# EAGLE design MSGP_rev2 (EAGLE 7.2.0)
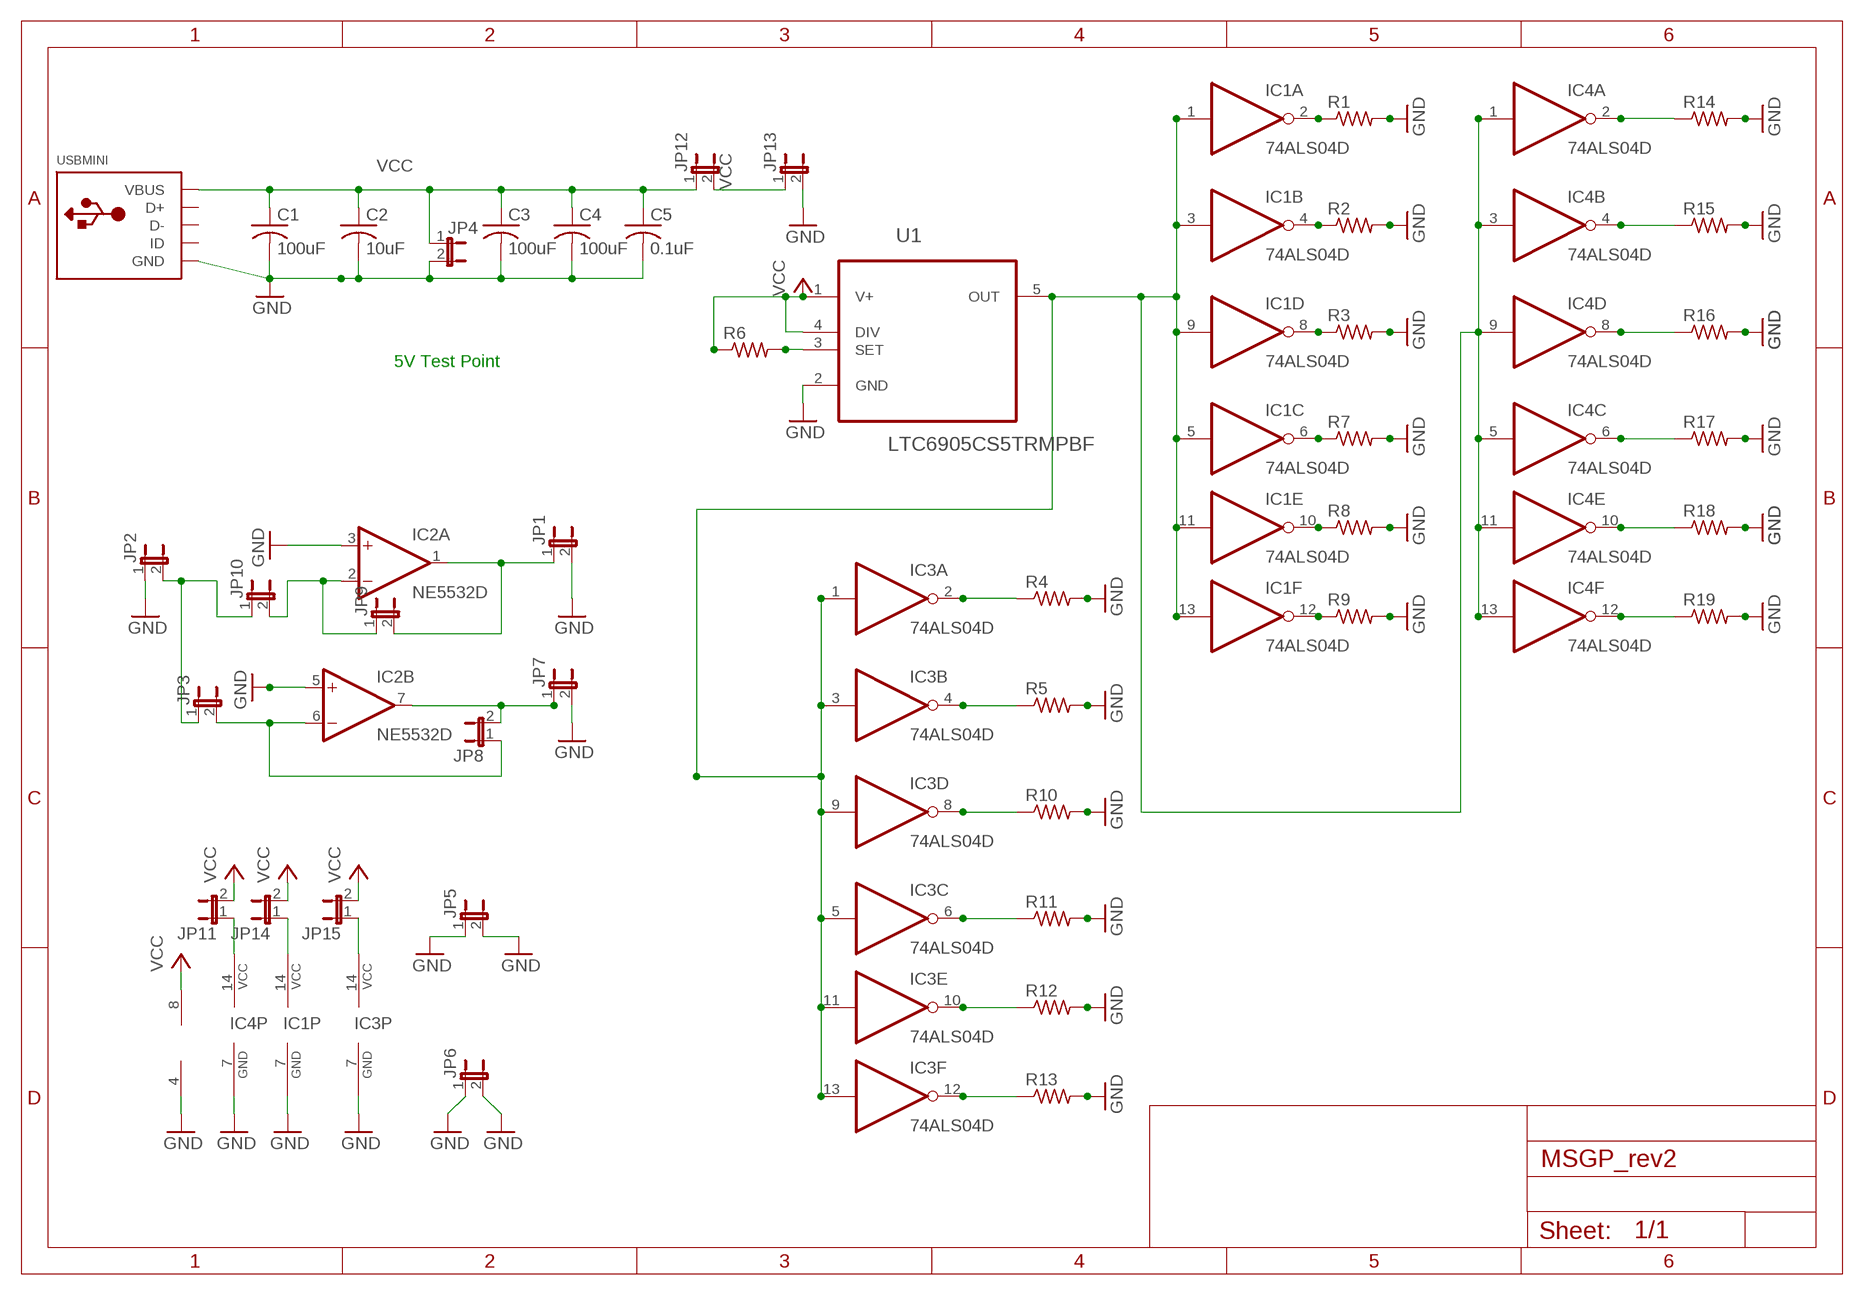
[diagram p0: schematic, sheet 1]

## Parts
C1  100uF  C-USC1206K  [C1206K]
C2  10uF  C-USC1206K  [C1206K]
C3  100uF  C-USC1206K  [C1206K]
C4  100uF  C-USC1206K  [C1206K]
C5  0.1uF  C-USC1206K  [C1206K]
IC1  74ALS04D  [SO14]
IC2  NE5532D  [SO08]
IC3  74ALS04D  [SO14]
IC4  74ALS04D  [SO14]
JP1  JP1E  [JP1]
JP2  JP1E  [JP1]
JP3  JP1E  [JP1]
JP4  JP1E  [JP1]
JP5  JP1E  [JP1]
JP6  JP1E  [JP1]
JP7  JP1E  [JP1]
JP8  JP1E  [JP1]
JP9  JP1E  [JP1]
JP10  JP1E  [JP1]
JP11  JP1E  [JP1]
JP12  JP1E  [JP1]
JP13  JP1E  [JP1]
JP14  JP1E  [JP1]
JP15  JP1E  [JP1]
R1  R-US_0204/2V  [0204V]
R2  R-US_0204/2V  [0204V]
R3  R-US_0204/2V  [0204V]
R4  R-US_0204/2V  [0204V]
R5  R-US_0204/2V  [0204V]
R6  R-US_0204/2V  [0204V]
R7  R-US_0204/2V  [0204V]
R8  R-US_0204/2V  [0204V]
R9  R-US_0204/2V  [0204V]
R10  R-US_0204/2V  [0204V]
R11  R-US_0204/2V  [0204V]
R12  R-US_0204/2V  [0204V]
R13  R-US_0204/2V  [0204V]
R14  R-US_0204/2V  [0204V]
R15  R-US_0204/2V  [0204V]
R16  R-US_0204/2V  [0204V]
R17  R-US_0204/2V  [0204V]
R18  R-US_0204/2V  [0204V]
R19  R-US_0204/2V  [0204V]
U1  LTC6905CS5TRMPBF  [SOT95P280X100-5N]
USBMINI  USBMINIB  [USB-MINIB]

## Nets
GND_D: IC1.7(P:GND) IC3.7(P:GND) IC4.7(P:GND) JP5.1 JP6.1 R1.2 R2.2 R3.2 R4.2 R5.2 R7.2 R8.2 R9.2 R10.2 R11.2 R12.2 R13.2 R14.2 R15.2 R16.2 R17.2 R18.2 R19.2 U1.2(GND) ; supply symbol labelled GND
GNDA: C1.2 C2.2 C3.2 C4.2 C5.2 IC2.3(A:+IN) IC2.4(P:V-) IC2.5(B:+IN) JP1.2 JP2.1 JP4.2 JP5.2 JP6.2 JP7.2 JP13.2 USBMINI.GND ; supply symbol labelled GND
N$1: IC1.1(A:I) IC1.3(B:I) IC1.5(C:I) IC1.9(D:I) IC1.11(E:I) IC1.13(F:I) IC3.1(A:I) IC3.3(B:I) IC3.5(C:I) IC3.9(D:I) IC3.11(E:I) IC3.13(F:I) IC4.1(A:I) IC4.3(B:I) IC4.5(C:I) IC4.9(D:I) IC4.11(E:I) IC4.13(F:I) U1.5(OUT)
N$2: IC2.6(B:-IN) JP3.2 JP8.1
N$3: IC2.1(A:OUT) JP1.1 JP9.2
N$4: IC1.10(E:O) R8.1
N$5: IC2.2(A:-IN) JP9.1 JP10.2
N$6: R6.2 U1.3(SET)
N$7: IC1.2(A:O) R1.1
N$8: IC1.4(B:O) R2.1
N$9: IC1.8(D:O) R3.1
N$10: IC1.6(C:O) R7.1
N$11: IC1.12(F:O) R9.1
N$12: IC2.7(B:OUT) JP7.1 JP8.2
N$14: IC3.10(E:O) R12.1
N$15: IC4.14(P:VCC) JP11.1
N$16: IC3.2(A:O) R4.1
N$17: IC3.4(B:O) R5.1
N$18: IC3.8(D:O) R10.1
N$19: IC3.6(C:O) R11.1
N$20: IC3.12(F:O) R13.1
N$21: IC4.10(E:O) R18.1
N$22: IC1.14(P:VCC) JP14.1
N$23: IC4.2(A:O) R14.1
N$24: IC4.4(B:O) R15.1
N$25: IC4.8(D:O) R16.1
N$26: IC4.6(C:O) R17.1
N$27: IC4.12(F:O) R19.1
N$28: IC3.14(P:VCC) JP15.1
N$30: JP2.2 JP3.1 JP10.1
VCC: C1.1 C2.1 C3.1 C4.1 C5.1 IC2.8(P:V+) JP4.1 JP11.2 JP12.1 JP12.2 JP13.1 JP14.2 JP15.2 R6.1 U1.1(V+) U1.4(DIV) USBMINI.VBUS
Unconnected: USBMINI.D+ USBMINI.D- USBMINI.ID

## Notes on the sheet
- 5V Test Point

## Library data of the parts
C1-C5 = adafruit:C-US: CAPACITOR, American symbol
IC1 IC3 IC4 = 74xx-us:74*04: Hex INVERTER
IC2 = linear:NE5532: AUDIO AMPLIFIER
JP1-JP15 = jumper:JP1E: JUMPER
R1-R19 = resistor:R-US_: RESISTOR, American symbol
U1 = LTC_By_element14_Batch_1:LTC6905CS5TRMPBF: 17MHz to 170MHz Resistor Oscillator; MPN: LTC6905CS5#TRMPBF; OC_FARNELL: 1663923; OC_NEWARK: 19P0750; PACKAGE: SOT-23-5; SUPPLIER: Linear Technology
USBMINI = adafruit:USB: USB Connectors USBMINIB - Surface Mount Female Mini-B USB Connector 4UConnector: 06564 By microbuilder.eu Thru-hole RA Female Mini-B USB Connector 4UConnector: 18732 By ladyada.net

## Board
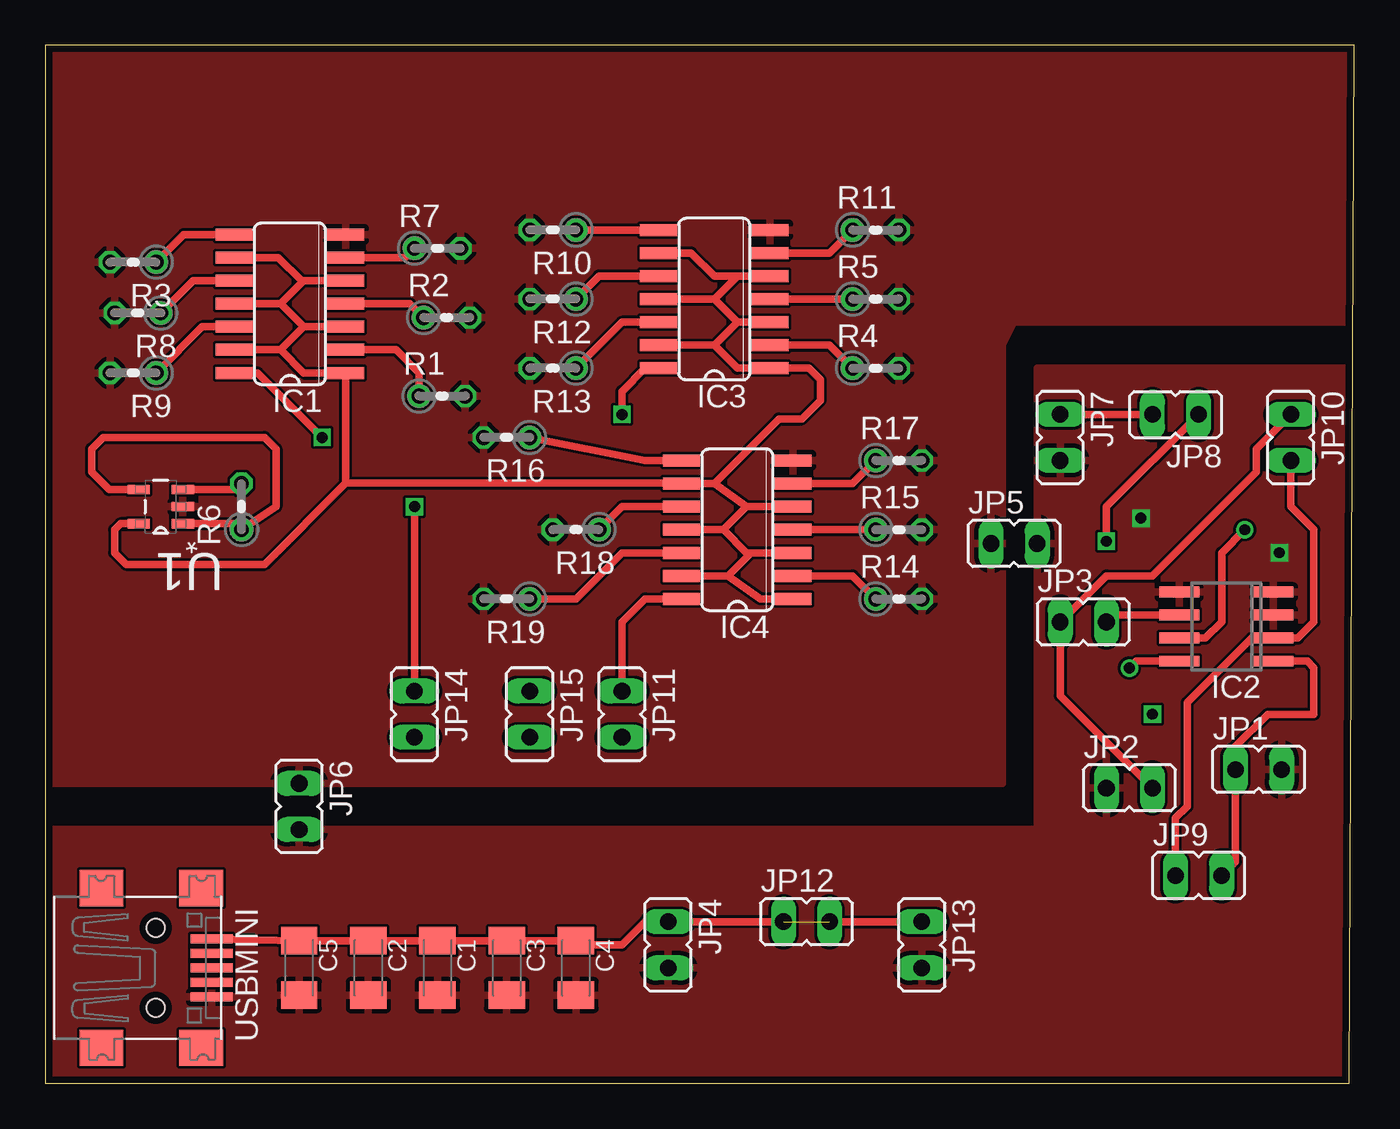
[diagram p1: board, top side]
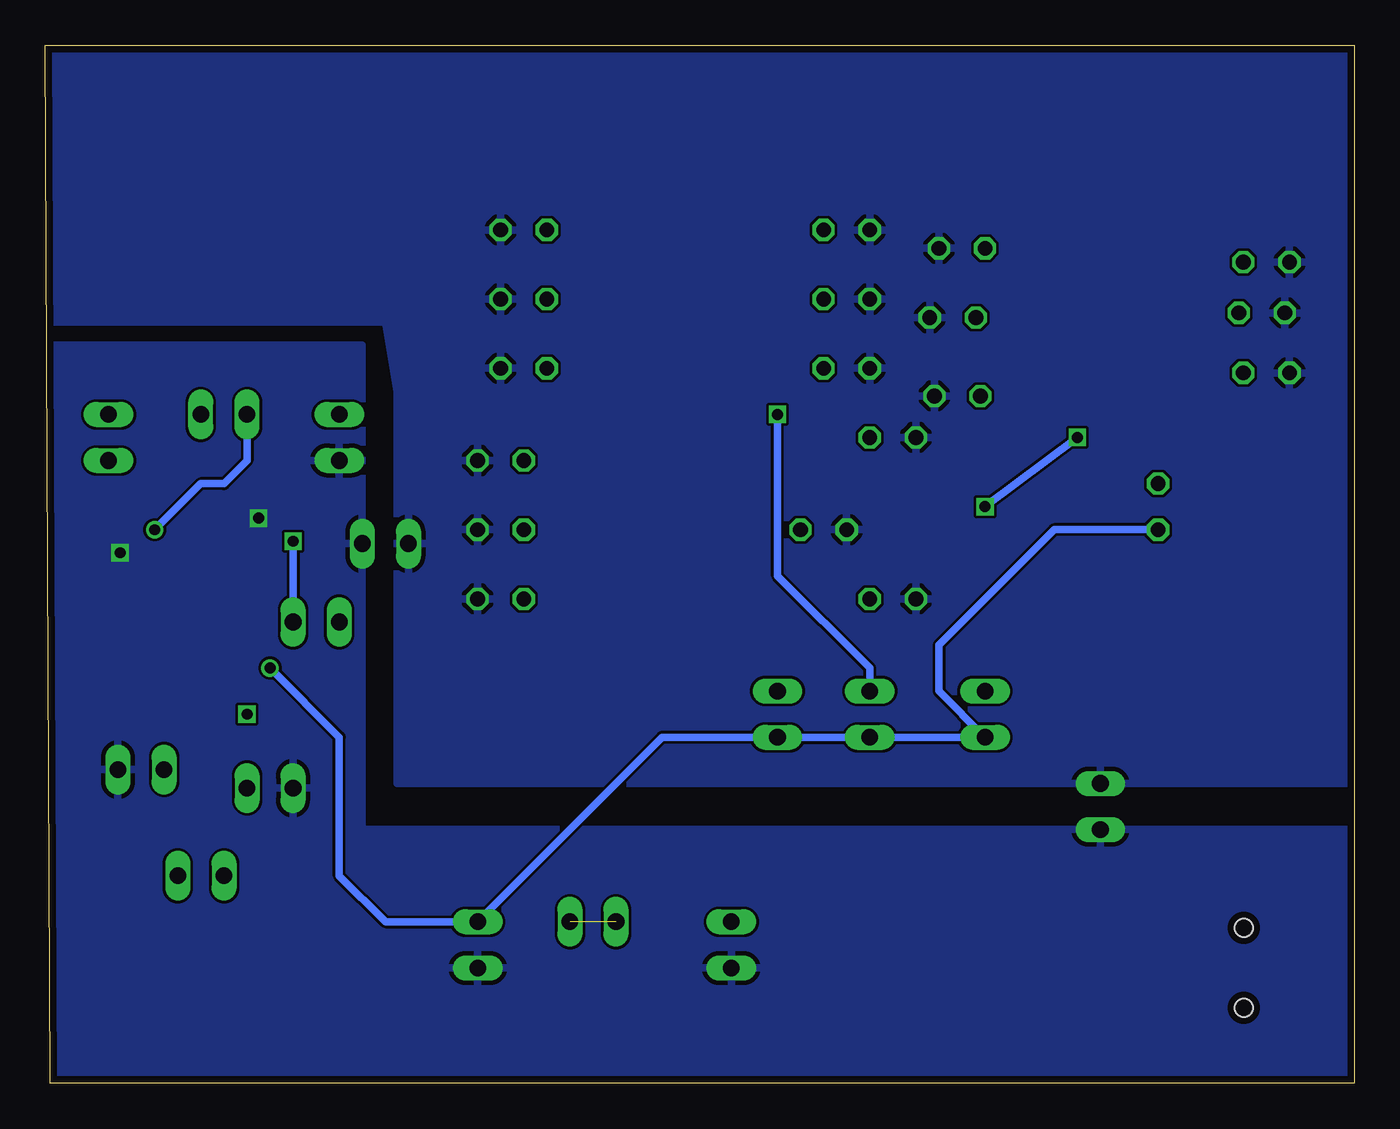
[diagram p2: board, bottom side, seen from below]

Size 72.06 x 57.15 mm. Coordinates in mm from the lower left corner, seen from the top.
Outline: 0,0 71.81,0 72.06,57.15 0,57.15 0,0
Copper layers (1*16): Top 0.0356mm / dielectric 1.5011mm / Bottom 0.0356mm
Design rules "OSHpark": minimum track width 6mil, minimum drill 13mil, track to track 6mil, track to pad 6mil, pad to pad 6mil, via to via 6mil, smd to smd 6mil, copper to edge 15mil, drill to drill 6mil, minimum pad ring 7mil, minimum via ring 7mil, stop-mask expansion 3mil, vias tented up to drill 0mil, thermal gap 10mil

### Footprints (pad centres in the part's own frame; a part is rotated, then mirrored left to right if it is on the bottom)
C1206K = smd 1.5 x 2: 1 -1.5,0; 2 1.5,0
SO14 = smd 0.66 x 2.032: 1 -3.81,-3.073; 2 -2.54,-3.073; 3 -1.27,-3.073; 4 0,-3.073; 5 1.27,-3.073; 6 2.54,-3.073; 7 3.81,-3.073; 8 3.81,3.073; 9 2.54,3.073; 10 1.27,3.073; 11 0,3.073; 12 -1.27,3.073; 13 -2.54,3.073; 14 -3.81,3.073
SO08 = smd 0.6 x 2.2: 1 -1.905,-2.6; 2 -0.635,-2.6; 3 0.635,-2.6; 4 1.905,-2.6; 5 1.905,2.6; 6 0.635,2.6; 7 -0.635,2.6; 8 -1.905,2.6
JP1 = drill 0.914 long: 1 0,-1.27; 2 0,1.27
0204V = drill 0.813 octagon: 1 -1.27,0; 2 1.27,0
SOT95P280X100-5N = smd 1.219 x 0.508: 1 -1.219,0.94; 2 -1.219,0; 3 -1.219,-0.94; 4 1.219,-0.94; 5 1.219,0.94
USB-MINIB = smd 0.5 x 2.308: D+ 0,4.064; D- -0.8,4.064; GND 1.6,4.064; ID 0.8,4.064; VBUS -1.6,4.064 | smd 2 x 2.4: GND1 -4.4,-2; GND2 -4.4,3.5; GND3 4.4,3.5; GND4 4.4,-2 | hole 1: -2.2,1; 2.2,1

### Placement (x,y rotation side)
C1  21.59,6.35 270 top
C2  17.78,6.35 270 top
C3  25.4,6.35 270 top
C4  29.21,6.35 270 top
C5  13.97,6.35 270 top
IC1  13.46,42.93 90 top
IC2  65.02,25.15 90 top
IC3  36.83,43.18 90 top
IC4  38.1,30.48 90 top
JP1  66.8,17.27 270 top
JP2  59.69,16.26 270 top
JP3  57.15,25.4 270 top
JP4  34.29,7.62 180 top
JP5  53.34,29.72 270 top
JP6  13.97,15.24 180 top
JP7  55.88,35.56 180 top
JP8  62.23,36.83 90 top
JP9  63.5,11.43 270 top
JP10  68.58,35.56 180 top
JP11  31.75,20.32 180 top
JP12  41.91,8.89 270 top
JP13  48.26,7.62 180 top
JP14  20.32,20.32 180 top
JP15  26.67,20.32 180 top
R1  21.84,37.85 0 top
R2  22.1,42.16 0 top
R3  4.83,45.21 180 top
R4  45.72,39.37 0 top
R5  45.72,43.18 0 top
R6  10.79,31.75 90 top
R7  21.59,45.97 0 top
R8  5.08,42.42 180 top
R9  4.83,39.12 180 top
R10  27.94,46.99 180 top
R11  45.72,46.99 0 top
R12  27.94,43.18 180 top
R13  27.94,39.37 180 top
R14  46.99,26.67 0 top
R15  46.99,30.48 0 top
R16  25.4,35.56 180 top
R17  46.99,34.29 0 top
R18  29.21,30.48 180 top
R19  25.4,26.67 180 top
U1  6.35,31.75 180 top
USBMINI  5.08,6.35 270 top

### Tracks (layer width: path | path; a pad name or v marks a point on that pad's centre or on a via)
GND_D
  pour Top: -1.27,58.42 73.66,58.42 73.66,41.91 53.34,41.91 52.7,40.64 52.7,16.51 -1.27,16.51
  pour Bottom: -1.27,57.15 73.66,57.15 73.66,41.91 53.34,41.91 52.7,38.1 52.7,16.51 -1.27,16.51
GNDA  (via drill 0.6)
  other vias: 60.33,31.11 67.94,29.21
  pour Top: -2.54,13.97 54.61,13.97 54.61,39.37 73.66,39.37 73.66,0 -2.54,0
  pour Bottom: 0,13.97 54.61,13.97 54.61,40.64 72.39,40.64 72.39,38.1 72.39,0 0,0
N$1
  Top 0.406: IC1.11 12.95,42.93 | 12.95,42.93 14.22,41.66 | IC3.11 36.83,43.18 | 36.83,43.18 38.1,44.45 IC3.5 36.83,44.45 35.56,45.72 IC3.9 | IC3.3 38.1,41.91 | 38.1,41.91 36.83,43.18 | IC3.13 36.83,40.64 | 36.83,40.64 38.1,41.91 | 36.83,40.64 38.1,39.37 IC3.1 42.04,39.37 42.67,38.73 42.67,37.59 41.66,36.58 40.39,36.58 36.83,33.02 | 36.83,33.02 IC4.9 35,33.05 16.54,33.05 | IC4.3 38.86,29.21 | IC4.1 39.37,26.67 37.59,27.94 | IC1.13 12.95,40.39 | 12.95,40.39 14.22,39.12 IC1.1 16.54,33.05 | 14.22,41.66 12.95,40.39 | 14.22,41.66 IC1.3 | IC1.9 12.83,45.47 14.1,44.2 14.22,44.2 | 12.95,42.93 14.22,44.2 | 14.22,44.2 IC1.5 | IC4.11 37.34,30.48 | 36.83,33.02 38.61,31.75 | 37.34,30.48 38.61,31.75 | 38.61,31.75 IC4.5 | 37.34,30.48 38.61,29.21 38.86,29.21 | IC4.13 37.59,27.94 | 37.59,27.94 38.86,29.21 | U1.5 4.14,30.81 3.81,30.48 3.81,29.21 4.45,28.57 12.06,28.57 16.54,33.05
N$2  (via drill 0.6)
  Top 0.406: IC2.6 58.8,25.78 JP3.2 | JP8.1 58.42,31.75 v58.42,29.84
  Bottom 0.406: v58.42,29.84 JP3.2
N$3
  Top 0.406: IC2.1 69.47,23.24 69.85,22.86 69.85,20.32 67.31,20.32 65.53,18.54 JP1.1 65.53,12.19 JP9.2
N$4
  Top 0.406: IC1.10 8.13,44.2 R8.1
N$5
  Top 0.406: JP10.2 68.58,31.75 69.85,30.48 69.85,25.4 68.96,24.51 IC2.2 66.42,24.51 62.87,20.95 62.87,15.24 62.23,14.61 JP9.1
N$6
  Top 0.406: R6.2 10.46,32.69 U1.3
N$7
  Top 0.406: IC1.2 19.3,40.39 20.57,39.12 R1.1
N$8
  Top 0.406: IC1.4 20.07,42.93 R2.1
N$9
  Top 0.406: IC1.8 7.62,46.74 R3.1
N$10
  Top 0.406: IC1.6 19.81,45.47 R7.1
N$11
  Top 0.406: IC1.12 8.64,41.66 R9.1
N$12  (via drill 0.6)
  Top 0.406: JP7.1 JP8.2 | IC2.7 63.88,24.51 64.77,25.4 64.77,29.21 v66.04,30.48
  Bottom 0.406: v66.04,30.48 63.5,33.02 62.23,33.02 60.96,34.29 JP8.2
N$14
  Top 0.406: IC3.10 30.48,44.45 R12.1
N$15
  Top 0.406: JP11.1 31.75,25.4 33.02,26.67 IC4.14
N$16
  Top 0.406: IC3.2 43.18,40.64 R4.1
N$17
  Top 0.406: IC3.4 R5.1
N$18
  Top 0.406: IC3.8 R10.1
N$19
  Top 0.406: IC3.6 43.18,45.72 R11.1
N$20
  Top 0.406: IC3.12 31.75,41.91 R13.1
N$21
  Top 0.406: IC4.10 31.75,31.75 R18.1
N$22  (via drill 0.6)
  Top 0.406: JP14.1 v20.32,31.75 | v15.24,35.56 11.68,39.12 IC1.14
  Bottom 0.406: v20.32,31.75 v15.24,35.56
N$23
  Top 0.406: IC4.2 44.45,27.94 R14.1
N$24
  Top 0.406: IC4.4 R15.1
N$25
  Top 0.406: IC4.8 33.02,34.29 R16.1
N$26
  Top 0.406: IC4.6 44.45,33.02 R17.1
N$27
  Top 0.406: IC4.12 31.75,29.21 29.21,26.67 R19.1
N$28  (via drill 0.6)
  Top 0.406: v31.75,36.83 31.75,38.1 33.02,39.37 IC3.14
  Bottom 0.406: JP15.1 26.67,22.86 31.75,27.94 v31.75,36.83
N$30
  Top 0.406: JP2.2 55.88,21.34 JP3.1 58.42,27.94 60.96,27.94 66.67,33.66 66.67,34.92 JP10.1
N$31  (via drill 0.6)
  other vias: 60.96,20.32
VCC  (via drill 0.6)  (1 unrouted)
  Top 0.406: JP12.2 JP13.1 | IC2.8 60.07,23.24 v59.69,22.86 | JP12.1 JP4.1 33.02,8.89 31.75,7.62 29.44,7.62 C4.1 C3.1 C1.1 C2.1 C5.1 USBMINI.VBUS | U1.4 3.5,32.69 2.54,33.66 2.54,34.92 3.17,35.56 12.06,35.56 12.7,34.92 12.7,31.75 R6.1 10.46,30.81 U1.1
  Bottom 0.406: v59.69,22.86 55.88,19.05 55.88,11.43 53.34,8.89 JP13.1 38.1,19.05 JP11.2 JP15.2 JP14.2 22.86,21.59 22.86,24.13 16.51,30.48 R6.1